# EAGLE design rickroll (EAGLE 6.5.0)
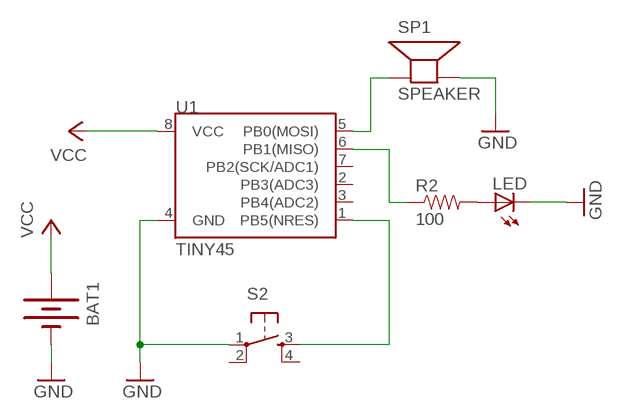
[diagram p0: schematic, sheet 1]

## Parts
BAT1  BATTERY20PTH  [BATTCOM_20MM_PTH]
LED  LEDCHIPLED_0805  [CHIPLED_0805]
R2  100  RESISTOR0603  [0603-RES]
S2  TAC_SWITCHPTH  [TACTILE-PTH]
SP1  SPEAKER  SPEAKER/AL60P  [AL60P]
U1  TINY45  ATTINY45TINY45-20-DIP  [DIP08]

## Nets
GND: BAT1.2(-) LED.C S2.1 SP1.2(-) U1.4(GND)
N$1: S2.3 U1.1(PB5(NRES))
N$3: SP1.1(+) U1.5(PB0(MOSI))
N$4: R2.1 U1.6(PB1(MISO))
N$5: LED.A R2.2
VCC: BAT1.1(+) U1.8(VCC)
Unconnected: S2.2 S2.4 U1.2(PB3(ADC3)) U1.3(PB4(ADC2)) U1.7(PB2(SCK/ADC1))

## Library data of the parts
BAT1 = SparkFun-Electromechanical:BATTERY: Battery Holders Various common sizes : AA, AAA, 20mm coin cell and 12mm coin cell. 20MM_4LEGS, BATT-10373
LED = adafruit:LED: LED OSRAM: - CHIPLED LG R971, LG N971, LY N971, LG Q971, LY Q971, LO R971, LY R971 LH N974, LH R974 LS Q976, LO Q976, LY Q976 LO Q996 - Hyper CHIPLED LW Q18S LB Q993, LB Q99A, LB R99A - SideLED LS A670, LO A670, LY A670, LG A670, LP A670 LB A673, LV A673, LT A673, LW A673 LH A674 LY A675 LS A676, LA A676, LO A676, LY A676, LW A676 LS A679, LY A679, LG A679 - Hyper Micro SIDELED® LS Y876, LA Y876, LO Y876, LY Y876 LT Y87S - SmartLED LW L88C, LW L88S LB L89C, LB L89S, LG L890 LS L89K, LO L89K, LY L89K LS L896, LA L896, LO L896, LY L896 - TOPLED LS T670, LO T670, LY T670, LG T670, LP T670 LSG T670, LSP T670, LSY T670, LOP T670, LYG T670 LG T671, LOG T671, LSG T671 LB T673, LV T673, LT T673, LW T673 LH T674 LS T676, LA T676, LO T676, LY T676, LB T676, LH T676, LSB T676, LW T676 LB T67C, LV T67C, LT T67C, LS T67K, LO T67K, LY T67K, LW E67C LS E67B, LA E67B, LO E67B, LY E67B, LB E67C, LV E67C, LT E67C LW T67C LS T679, LY T679, LG T679 LS T770, LO T770, LY T770, LG T770, LP T770 LB T773, LV T773, LT T773, LW T773 LH T774 LS E675, LA E675, LY E675, LS T675 LS T776, LA T776, LO T776, LY T776, LB T776 LHGB T686 LT T68C, LB T68C - Hyper Mini TOPLED® LB M676 - Mini TOPLED Santana® LG M470 LS M47K, LO M47K, LY M47K Source: http://www.osram.convergy.de/
R2 = SparkFun-Resistors:RESISTOR: Resistor Basic schematic elements and footprints for 0603, 1206, and PTH resistors.
S2 = SparkFun-Electromechanical:TAC_SWITCH: Momentary Switch Button commonly used for reset or general input. Spark Fun Electronics SKU : COM-00097 SMT- SWCH-08247
SP1 = adafruit:SPEAKER: SPEAKER Source: Buerklin Added PS12 (for part # PS1240 piezo) http://www.ladyada.net/library/pcb/eaglelibrary.html
U1 = SparkFun-DigitalIC:ATTINY45: Atmel 8-pin 2/4/8kB flash uC; PROD_ID: IC-09439; VALUE: TINY45-20-DIP

## Net classes
0 default: width 0.3 mm

## Board
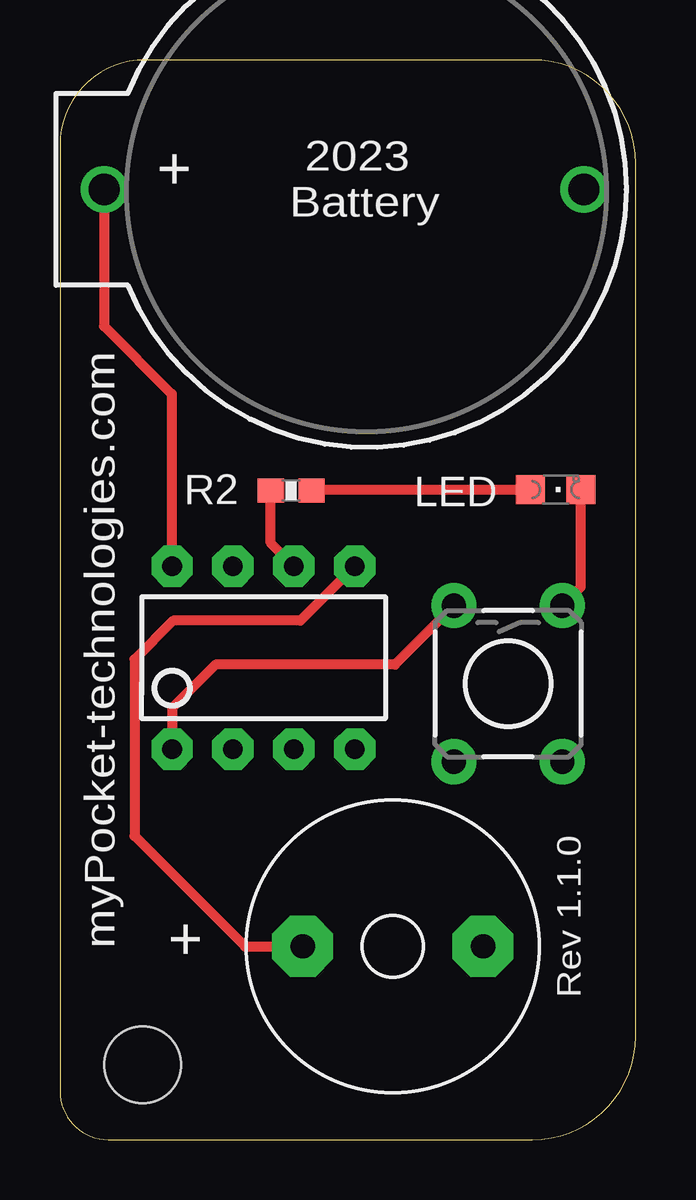
[diagram p1: board, top side]
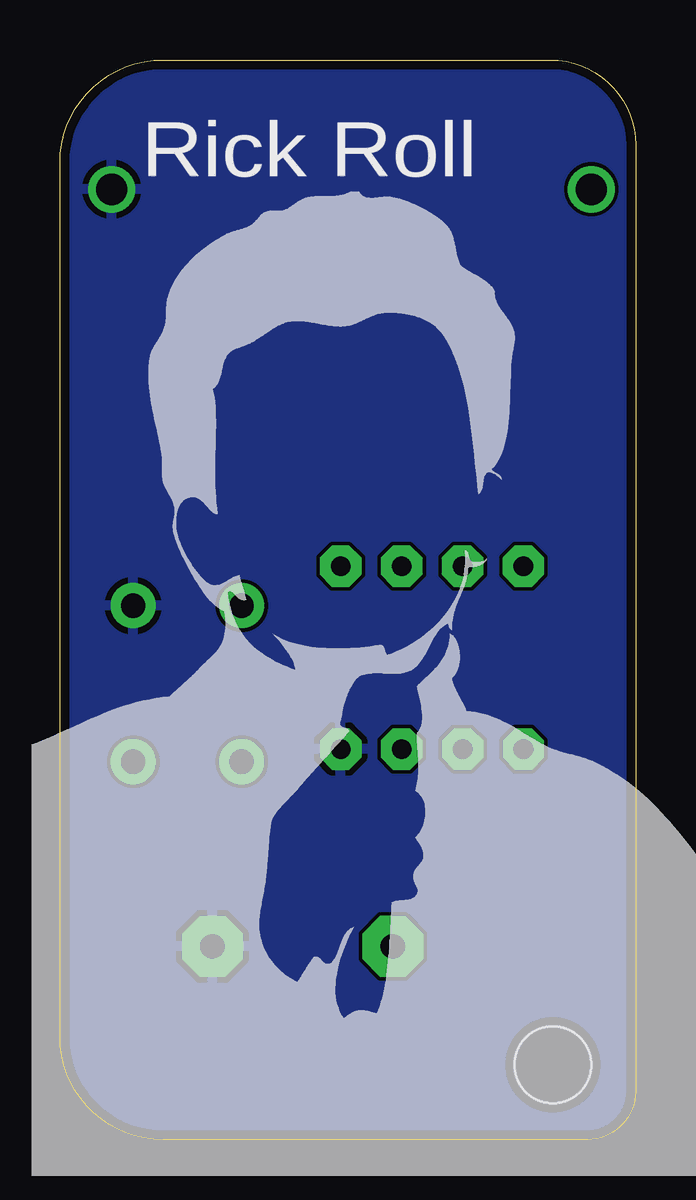
[diagram p2: board, bottom side, seen from below]

Size 24 x 45 mm. Coordinates in mm from the lower left corner, seen from the top.
Outline: 0,2 arc90 2,0 19.7,0 arc90 24,4.3 24,40.7 arc90 19.7,45 3.54,45 arc90 0,41.46 0,2
Copper layers (1*16): Top 0.0356mm / dielectric 1.5011mm / Bottom 0.0356mm
Design rules "LaenPCBOrder": minimum track width 6mil, minimum drill 13mil, track to track 6mil, track to pad 6mil, pad to pad 6mil, via to via 6mil, smd to smd 6mil, copper to edge 15mil, drill to drill 6mil, minimum pad ring 7mil, minimum via ring 7mil, stop-mask expansion 4mil, vias tented up to drill 0mil, thermal gap 10mil
Holes 3.2 mm at 3.44,3.11

### Footprints (pad centres in the part's own frame; a part is rotated, then mirrored left to right if it is on the bottom)
BATTCOM_20MM_PTH = drill 1.3: 1 20,0; 2 0,0
CHIPLED_0805 = smd 1.2 x 1.2: A 0,-1.05; C 0,1.05
0603-RES = smd 1.1 x 1: 1 -0.85,0; 2 0.85,0
TACTILE-PTH = drill 1.016 pad 1.88: 1 -3.251,2.261; 2 3.251,2.261; 3 -3.251,-2.261; 4 3.251,-2.261
AL60P = drill 1.016 pad 2.54 octagon: 1 -3.759,0; 2 3.759,0
DIP08 = drill 0.813 pad 1.727 octagon: 1 -3.81,-3.81; 2 -1.27,-3.81; 3 1.27,-3.81; 4 3.81,-3.81; 5 3.81,3.81; 6 1.27,3.81; 7 -1.27,3.81; 8 -3.81,3.81

### Placement (x,y rotation side)
BAT1  21.84,39.61 180 top
LED  20.67,27.09 270 top
R2  9.64,27.05 0 top
S2  18.69,19 270 top
SP1  13.88,8.05 0 top
U1  8.49,20.09 0 top
U$1  [RICK]  25.03,-1.35 0 bottom

### Tracks (layer width: path | path; a pad name or v marks a point on that pad's centre or on a via)
GND
  Top 0.406: S2.1 21.72,23.03 LED.C
  pour Bottom: -1.5,48 28.5,48 27.5,-2.15 -2.16,-1.46 arc-90 -2.57,-1.03
N$1
  Top 0.406: S2.3 13.97,19.8 6.49,19.8 4.68,17.99 U1.1
N$3
  Top 0.406: U1.5 10.02,21.63 4.73,21.63 3.11,20.01 3.11,12.65 7.71,8.05 SP1.1
N$4
  Top 0.406: U1.6 8.79,24.87 R2.1
N$5
  Top 0.406: R2.2 10.53,27.09 LED.A
VCC
  Top 0.406: BAT1.1 1.84,33.91 4.67,31.08 4.67,23.91 U1.8

### Text on the board
tPlace: Rev 1.1.0
bPlace: Rick Roll
tNames: + | 2023 / Battery | myPocket-technologies.com | +